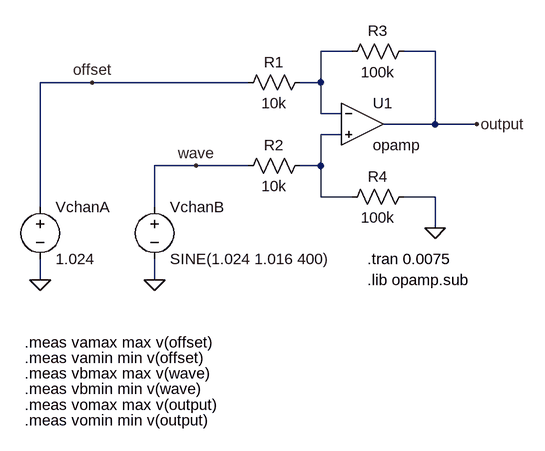
[diagram p0: schematic offset-dac-circuit.asc]
offset-dac-circuit.asc, the LTspice schematic file:
Version 4
SHEET 1 880 680
WIRE 448 -176 400 -176
WIRE 576 -176 528 -176
WIRE 48 -128 -32 -128
WIRE 288 -128 48 -128
WIRE 400 -128 400 -176
WIRE 400 -128 368 -128
WIRE 400 -80 400 -128
WIRE 432 -80 400 -80
WIRE 576 -64 576 -176
WIRE 576 -64 496 -64
WIRE 640 -64 576 -64
WIRE 432 -48 400 -48
WIRE 208 0 144 0
WIRE 288 0 208 0
WIRE 400 0 400 -48
WIRE 400 0 368 0
WIRE 400 48 400 0
WIRE 448 48 400 48
WIRE 576 48 528 48
WIRE -32 64 -32 -128
WIRE 144 64 144 0
WIRE 576 96 576 48
WIRE -32 176 -32 144
WIRE 144 176 144 144
FLAG 144 176 0
FLAG -32 176 0
FLAG 576 96 0
FLAG 48 -128 offset
FLAG 208 0 wave
FLAG 640 -64 output
SYMBOL voltage -32 48 R0
SYMATTR InstName VchanA
SYMATTR Value 1.024
SYMBOL voltage 144 48 R0
WINDOW 123 0 0 Left 0
WINDOW 39 0 0 Left 0
SYMATTR InstName VchanB
SYMATTR Value SINE(1.024 1.016 400)
SYMBOL res 384 -144 R90
WINDOW 0 0 56 VBottom 2
WINDOW 3 32 56 VTop 2
SYMATTR InstName R1
SYMATTR Value 10k
SYMBOL res 384 -16 R90
WINDOW 0 0 56 VBottom 2
WINDOW 3 32 56 VTop 2
SYMATTR InstName R2
SYMATTR Value 10k
SYMBOL res 544 -192 R90
WINDOW 0 0 56 VBottom 2
WINDOW 3 32 56 VTop 2
SYMATTR InstName R3
SYMATTR Value 100k
SYMBOL res 544 32 R90
WINDOW 0 0 56 VBottom 2
WINDOW 3 32 56 VTop 2
SYMATTR InstName R4
SYMATTR Value 100k
SYMBOL OpAmps\\opamp 464 -128 R0
SYMATTR InstName U1
TEXT 472 144 Left 2 !.tran 0.0075
TEXT 472 176 Left 2 !.lib opamp.sub
TEXT -56 272 Left 2 !.meas vamax max v(offset)
TEXT -56 296 Left 2 !.meas vamin min v(offset)
TEXT -56 320 Left 2 !.meas vbmax max v(wave)
TEXT -56 344 Left 2 !.meas vbmin min v(wave)
TEXT -56 368 Left 2 !.meas vomax max v(output)
TEXT -56 392 Left 2 !.meas vomin min v(output)

The netlist it stands for:
* offset-dac-circuit.asc
VchanA offset 0 1.024
VchanB wave 0 SINE(1.024 1.016 400)
R1 N001 offset 10k
R2 N002 wave 10k
R3 output N001 100k
R4 0 N002 100k
XU1 N001 N002 output opamp Aol=100K GBW=10Meg  ; pins invin noninvin out
.tran 0.0075
.lib opamp.sub
.meas vamax max v(offset)
.meas vamin min v(offset)
.meas vbmax max v(wave)
.meas vbmin min v(wave)
.meas vomax max v(output)
.meas vomin min v(output)
.backanno
.end